# Altium schematic sheet [2]_PI_ZERO.SchDoc
size A4
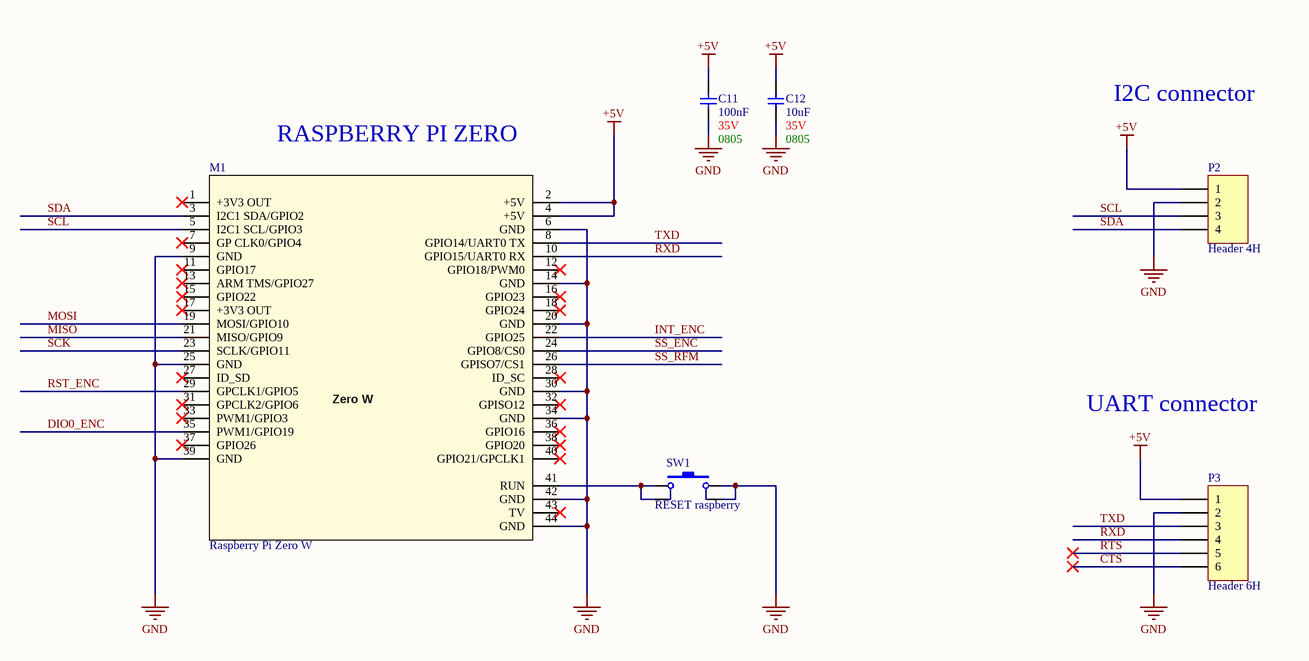
[diagram p0: [2]_PI_ZERO.SchDoc]

## Parts
C11  value 100nF  Voltage: 35V  Package: 0805  [Capacitor_0805]  (hidden comment: Capacitor SMD 0805)
C12  value 10uF  Voltage: 35V  Package: 0805  [Capacitor_0805]  (hidden comment: Capacitor SMD 0805)
M1  Raspberry Pi Zero W  [RPi-zero]
P2  Header 4H  [HDR1X4]
P3  Header 6H  [HDR1X6]
SW1  RESET raspberry  [Tact_SWITCH 6x6mm]

## Nets
+5V: C11.2 C12.2 M1.2(+5V) M1.4(+5V) P2.1 P3.1
GND: C11.1 C12.1 M1.6(GND) M1.9(GND) M1.14(GND) M1.20(GND) M1.25(GND) M1.30(GND) M1.34(GND) M1.39(GND) M1.42(GND) M1.44(GND) M1.45(M) M1.46(M) M1.47(M) M1.48(M) P2.2 P3.2 SW1.3 SW1.4
CTS: P3.6
DIO0_ENC: M1.35(PWM1/GPIO19)
INT_ENC: M1.22(GPIO25)
MISO: M1.21(MISO/GPIO9)
MOSI: M1.19(MOSI/GPIO10)
RST_ENC: M1.29(GPCLK1/GPIO5)
RTS: P3.5
RXD: M1.10(GPIO15/UART0_RX) P3.4
SCK: M1.23(SCLK/GPIO11)
SCL: M1.5(I2C1_SCL/GPIO3) P2.3
SDA: M1.3(I2C1_SDA/GPIO2) P2.4
SS_ENC: M1.24(GPIO8/CS0)
SS_RFM: M1.26(GPISO7/CS1)
TXD: M1.8(GPIO14/UART0_TX) P3.3
NetM1_41: M1.41(RUN) SW1.1 SW1.2

Not connected (* = marked no-connect by the designer): M1 1(+3V3_OUT)* 7(GP_CLK0/GPIO4)* 11(GPIO17)* 12(GPIO18/PWM0)* 13(ARM_TMS/GPIO27)* 15(GPIO22)* 16(GPIO23)* 17(+3V3_OUT)* 18(GPIO24)* 27(ID_SD)* 28(ID_SC)* 31(GPCLK2/GPIO6)* 32(GPISO12)* 33(PWM1/GPIO3)* 36(GPIO16)* 37(GPIO26)* 38(GPIO20)* 40(GPIO21/GPCLK1)* 43(TV)*

## Notes on the sheet
- Labels drawn without touching a wire or pin: I2C connector, RASPBERRY PI ZERO, UART connector
- (in symbol Raspberry Pi Zero W) Zero W

## Library data of the parts
C11 C12 = Capacitor SMD 0805: Ceramic Capacitor SMD 0805; Tolerance: 10%
M1 = Raspberry Pi Zero W: Raspberry Pi Zero W module
P2 = Header 4: Header, 4-Pin; LatestRevisionDate: 17-Jul-2002; LatestRevisionNote: Re-released for DXP Platform.; Publisher: Altium Limited
P3 = Header 6: Header, 6-Pin; LatestRevisionDate: 17-Jul-2002; LatestRevisionNote: Re-released for DXP Platform.; Publisher: Altium Limited
SW1 = Switch 6x6mm SMD SPST-NO: SCHURTER 1301.9315 - 6x6 mm tact switches